# EAGLE design bus_extender (EAGLE 9.6.1)
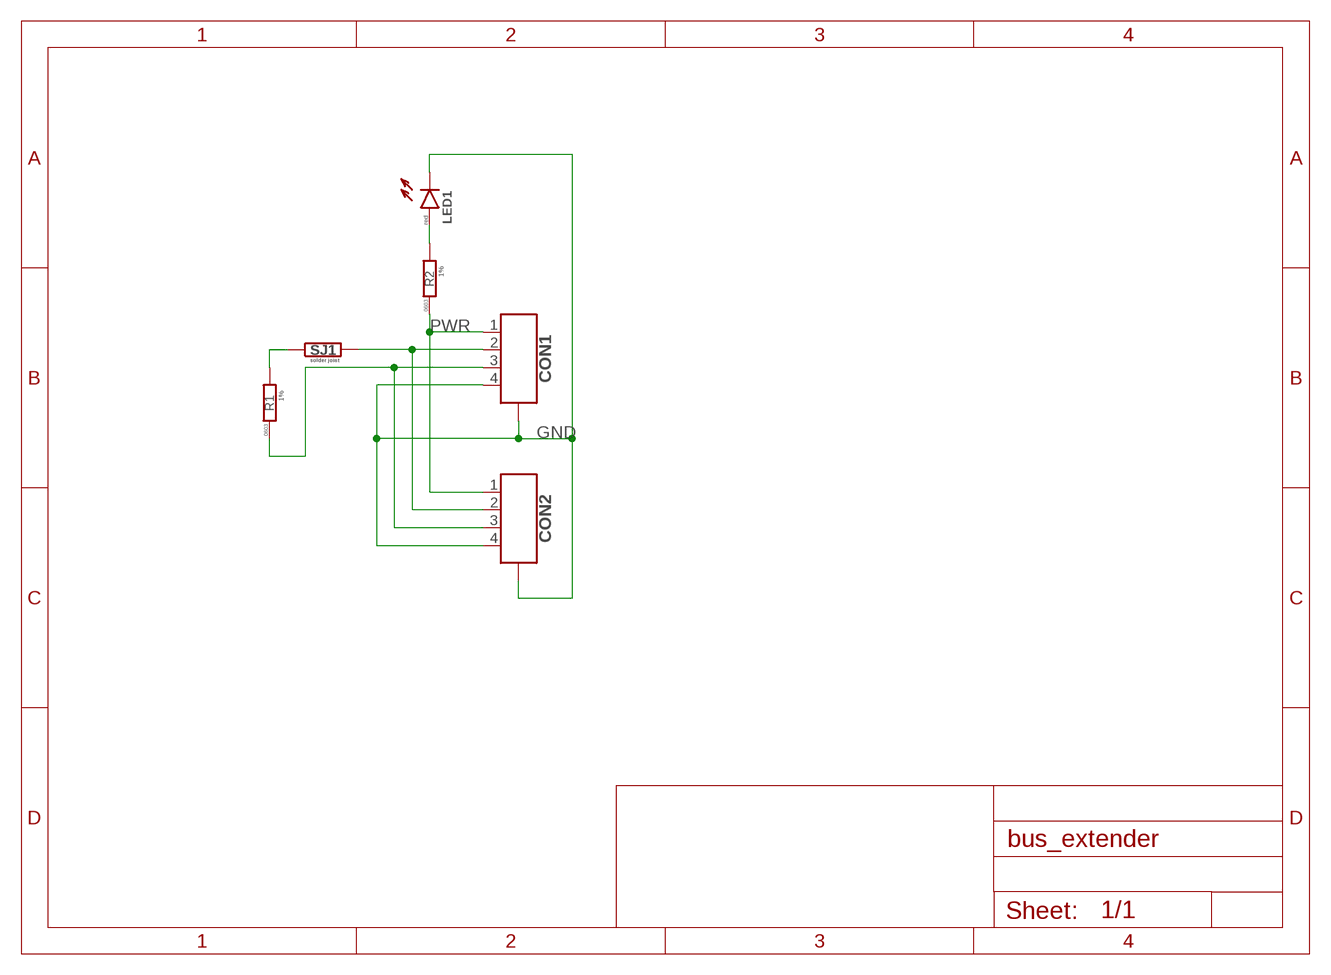
[diagram p0: schematic, sheet 1]

## Parts
CON1  CON-4P-TABS-JST_GH-RA  [JST_GH-4P-RA]
CON2  CON-4P-TABS-JST_GH-RA  [JST_GH-4P-RA]
LED1  LED-0603  [LED0603]
R1  R-1%-0603  [R0603]
R2  R-1%-0603  [R0603]
SJ1  SOLDER_JOINT  [RES_0]

## Nets
GND: CON1.4 CON1.M$0(GND) CON1.M$1(GND) CON2.4 CON2.M$0(GND) CON2.M$1(GND) LED1.C
N$1: LED1.A R2.2
N$2: CON1.2 CON2.2 SJ1.2
N$3: CON1.3 CON2.3 R1.1
N$4: R1.2 SJ1.1
PWR: CON1.1 CON2.1 R2.1

## Library data of the parts
CON1 CON2 = Connectors:CON-4P-TABS: Connector Receptacle 4 Position 0.049" (1.25mm) Tin Surface Mount; DIGIKEY#: 455-1566-1-ND; MANF: JST Sales America Inc; MANF#: SM04B-GHS-TB(LF)(SN)
LED1 = rc:LED: SMD LED; COLOR: red
R1 R2 = rc:R; PACKAGE: 0603; TOLERANCE: 1%
SJ1 = misc:SOLDER_JOINT

## Board
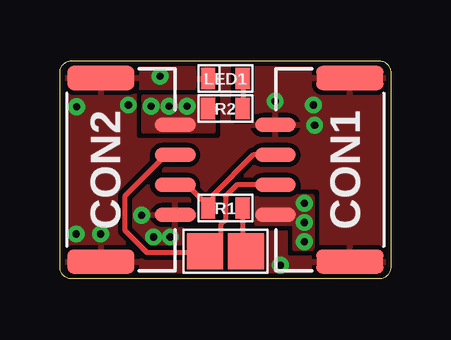
[diagram p1: board, top side]
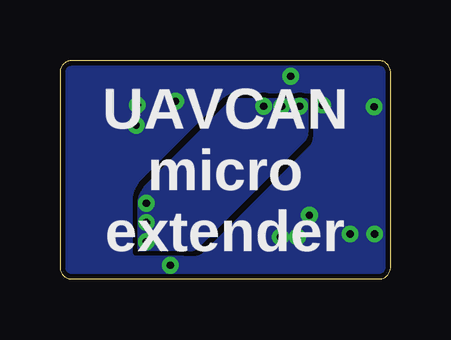
[diagram p2: board, bottom side, seen from below]

Size 13.8 x 9.1 mm. Coordinates in mm from the lower left corner, seen from the top.
Outline: 13.3,0 0.5,0 arc-90 0,0.5 0,8.6 arc-90 0.5,9.1 13.3,9.1 arc-90 13.8,8.6 13.8,0.5 arc-90 13.3,0
Copper layers (1*16): Top 0.035mm / dielectric 1mm / Bottom 0.035mm
Design rules "usb2can_drc *": minimum track width 0.2mm, minimum drill 0.2mm, track to track 0.2mm, track to pad 0.2mm, pad to pad 0.2mm, via to via 0.2mm, smd to smd 0.15mm, copper to edge 0.2mm, drill to drill 0.2mm, minimum pad ring 0.125mm, minimum via ring 0.125mm, stop-mask expansion 1mil, vias tented up to drill 0.31mm, thermal gap 8mil

### Footprints (pad centres in the part's own frame; a part is rotated, then mirrored left to right if it is on the bottom)
JST_GH-4P-RA = smd 0.6 x 1.7: 1 1.875,-2.91; 2 0.625,-2.91; 3 -0.625,-2.91; 4 -1.875,-2.91 | smd 1 x 2.8: M$0 -3.825,0.19; M$1 3.825,0.19
LED0603 = smd 0.6 x 0.9: A -0.725,0; C 0.725,0
R0603 = smd 0.6 x 0.9: 1 -0.725,0; 2 0.725,0
RES_0 = smd 1.5 x 1.5: 1 -0.85,0; 2 0.85,0

### Placement (x,y rotation side)
CON1  11.9,4.55 270 top
CON2  1.9,4.55 90 top
LED1  6.9,8.35 180 top
R1  6.9,2.95 0 top
R2  6.9,7.1 0 top
SJ1  6.9,1.15 180 top

### Tracks (layer width: path | path; a pad name or v marks a point on that pad's centre or on a via)
GND  (via drill 0.3 pad 0.7)
  other vias: 4.6,1.75 3.9,1.75 3.4,2.65 1.7,1.88 0.68,1.88 0.7,7.17 2.85,7.25 4.18,8.45 10.62,6.4 10.57,7.25 8.98,7.4 9.2,0.57
  pour Top (rank 5): 0,9.15 13.8,9.15 13.8,0.05 0,0.05
  pour Bottom (rank 5): 13.8,9.15 0,9.15 0,0.05 13.8,0.05
N$1
  Top 0.2: LED1.A R2.2
N$2
  Top 0.2: CON1.2 7.38,3.92 6.9,3.45 6.9,2.45 6.7,2.25 6.7,1.25 6.6,1.15 SJ1.2 6,1.1 3.63,1.1 2.73,2.01 2.73,3.47 4.43,5.17 CON2.2
N$3
  Top 0.2: CON2.3 5.3,3.92 5.98,3.25 5.98,3.15 R1.1 6.38,3.15 6.38,3.49 8.06,5.17 CON1.3
N$4
  Top 0.2: SJ1.1 7.62,1.27 R1.2
PWR  (via drill 0.3 pad 0.7)
  other vias: 10.2,3.15 10.2,2.35 10.2,1.55 3.8,7.2 4.55,7.2 5.3,7.2
  pour Top (no thermals): 10.5,1.25 9.8,1.25 9.8,2.3 8.2,2.3 8.2,3.45 10.5,3.45
  pour Top (no thermals): 6.38,6.15 3.5,6.15 3.5,7.6 6.38,7.6
  pour Bottom: 3.55,7.45 3.55,6.11 arc45 3.7,5.75 8.05,1.4 arc45 8.41,1.25 10.45,1.25 10.45,3.14 arc45 10.16,3.84 6.74,7.26 arc45 6.28,7.45

### Text on the board
bPlace: UAVCAN / micro / extender